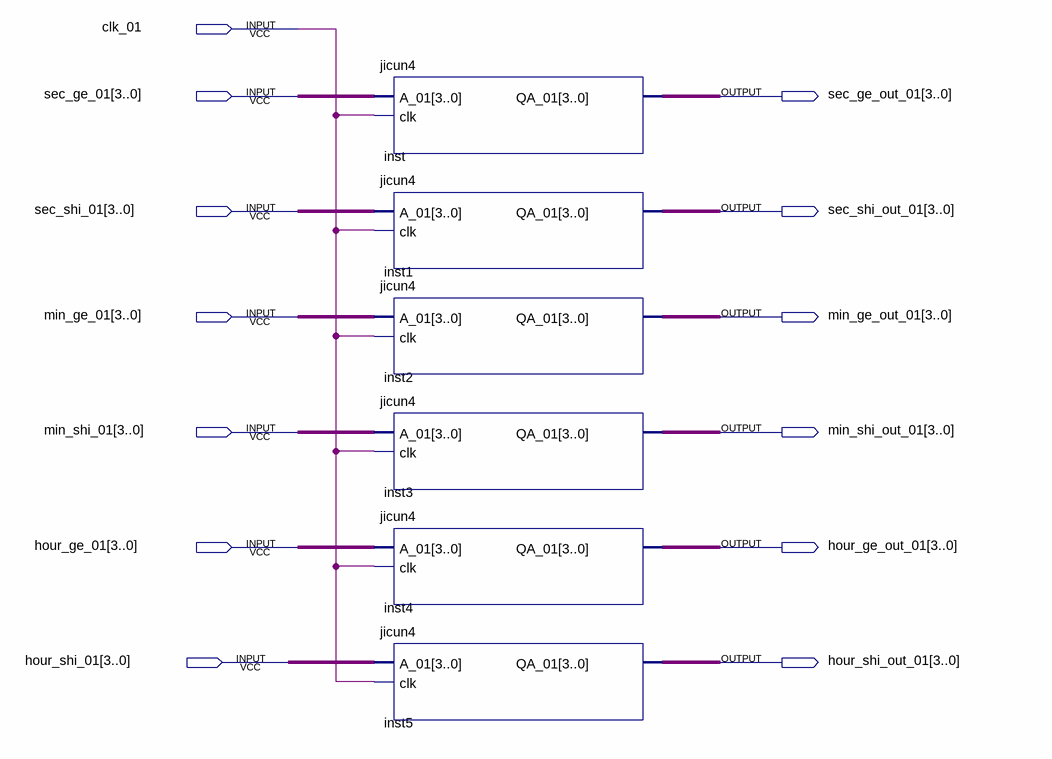
[diagram p0: schematic sheet]
// Quartus schematic jicun8.bdf as structural Verilog: 6 symbols, 13 pins
module jicun8 (
  input  clk_01,
  input  [3:0] sec_ge_01,
  input  [3:0] sec_shi_01,
  input  [3:0] min_ge_01,
  input  [3:0] min_shi_01,
  input  [3:0] hour_ge_01,
  input  [3:0] hour_shi_01,
  output [3:0] sec_ge_out_01,
  output [3:0] sec_shi_out_01,
  output [3:0] min_ge_out_01,
  output [3:0] min_shi_out_01,
  output [3:0] hour_ge_out_01,
  output [3:0] hour_shi_out_01
);

  jicun4 inst (.A_01(sec_ge_01), .clk(clk_01), .QA_01(sec_ge_out_01));
  jicun4 inst1 (.A_01(sec_shi_01), .clk(clk_01), .QA_01(sec_shi_out_01));
  jicun4 inst2 (.A_01(min_ge_01), .clk(clk_01), .QA_01(min_ge_out_01));
  jicun4 inst3 (.A_01(min_shi_01), .clk(clk_01), .QA_01(min_shi_out_01));
  jicun4 inst4 (.A_01(hour_ge_01), .clk(clk_01), .QA_01(hour_ge_out_01));
  jicun4 inst5 (.A_01(hour_shi_01), .clk(clk_01), .QA_01(hour_shi_out_01));
endmodule
